# Altium schematic sheet Modulo bluetooth.SchDoc
size A3
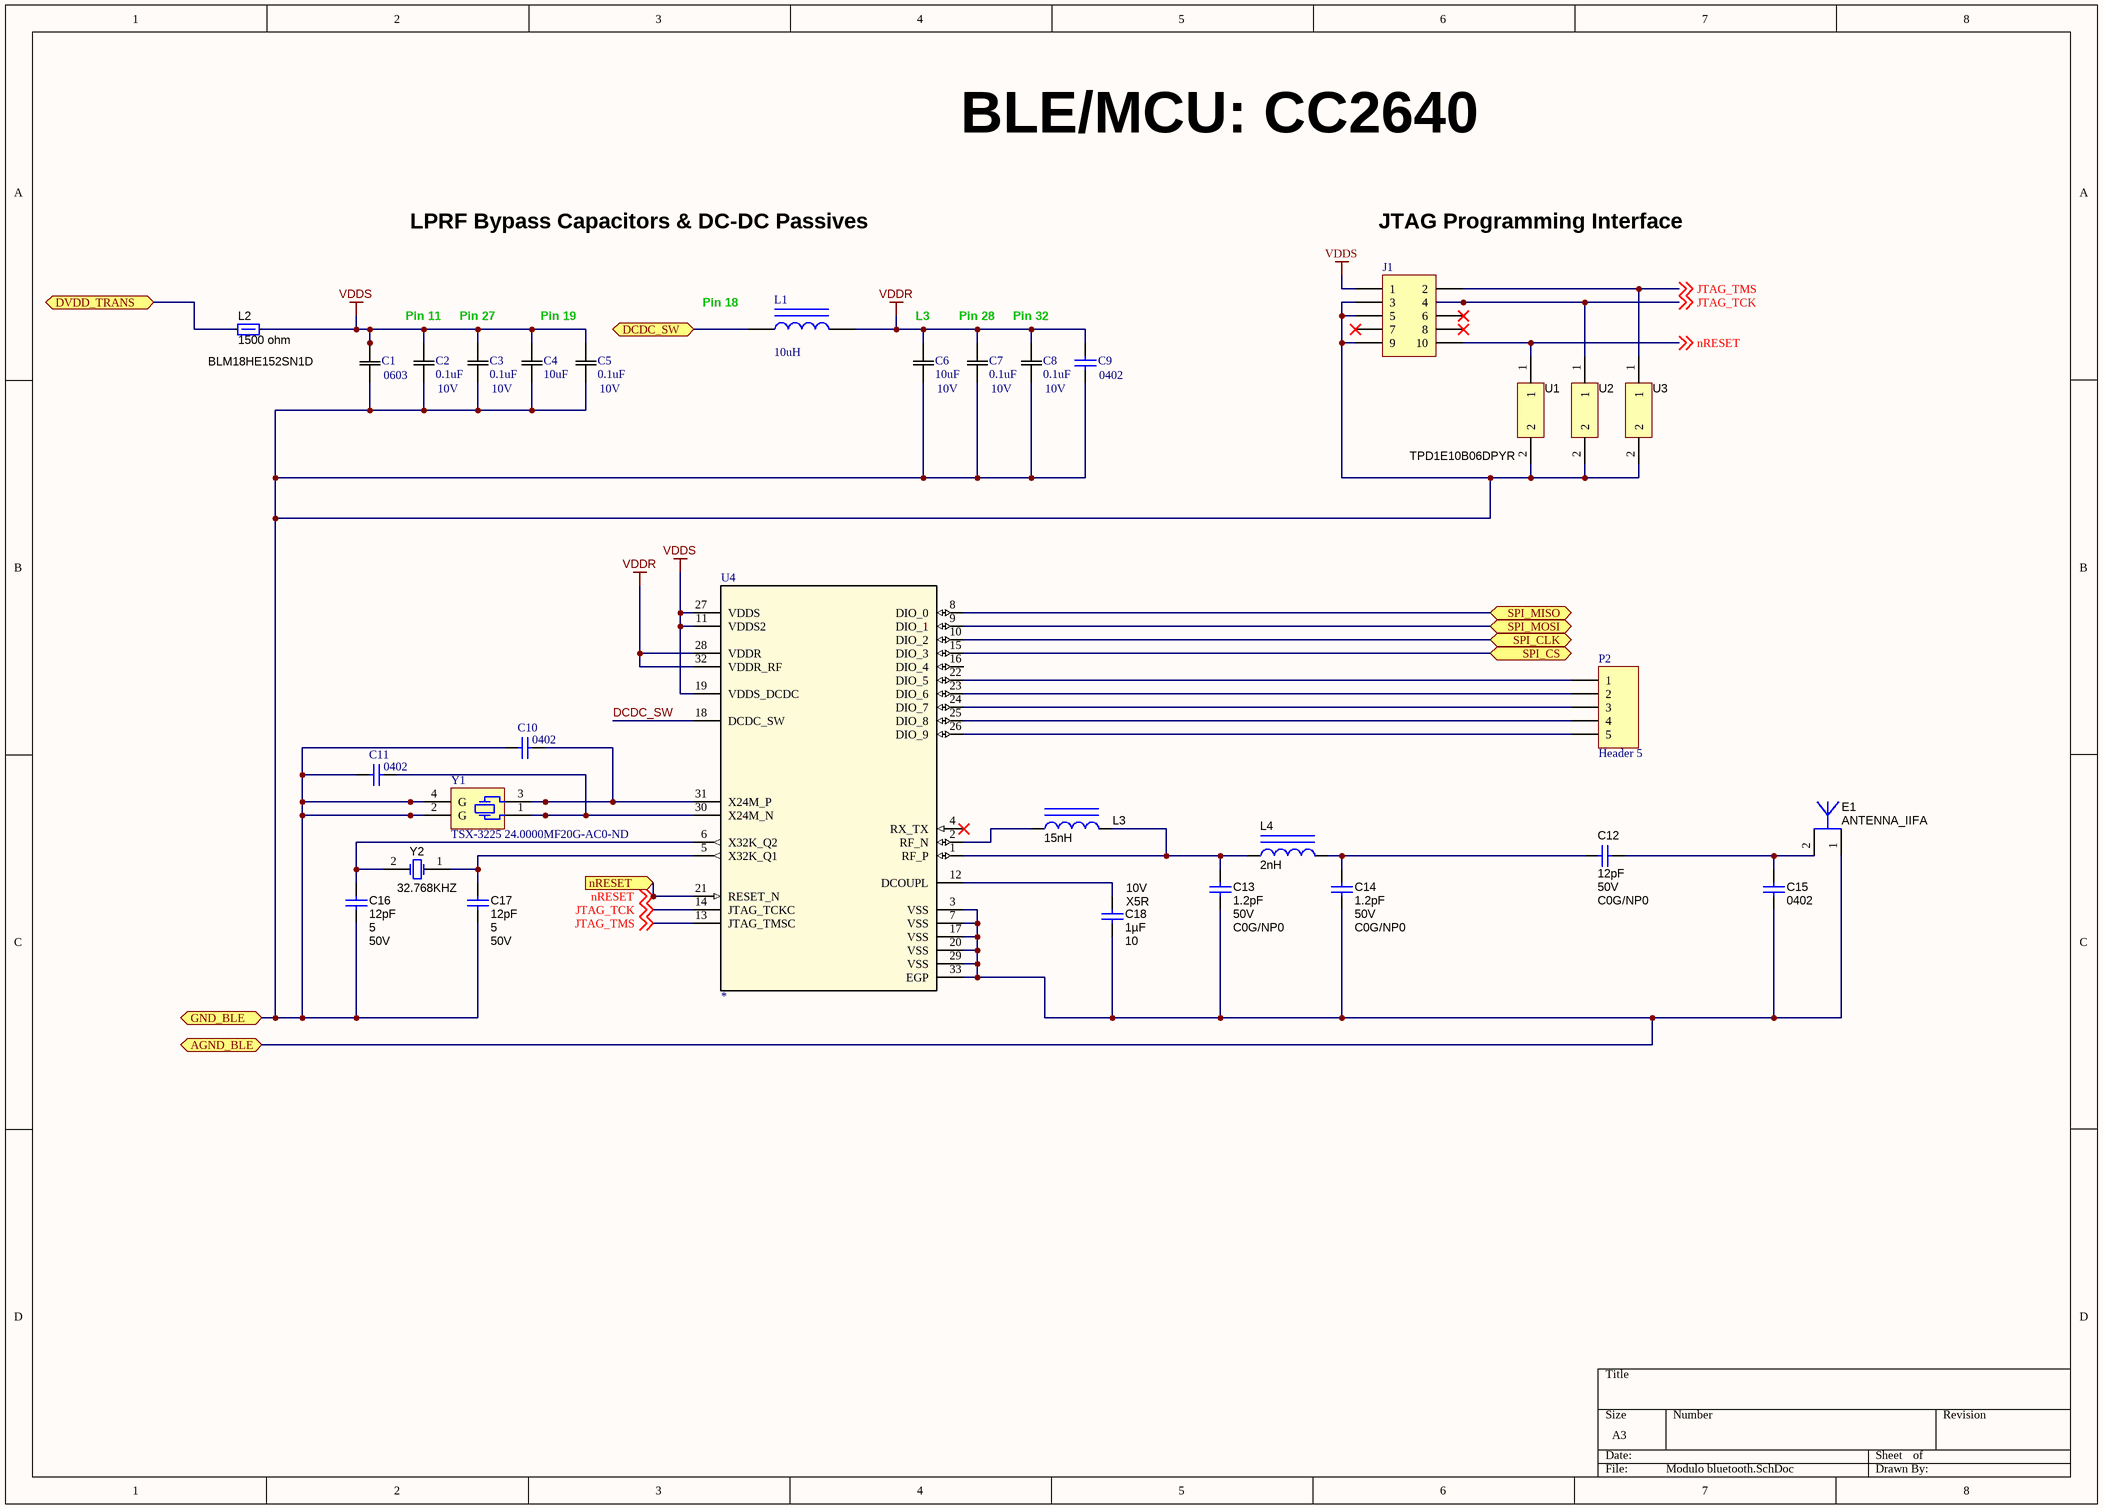
[diagram p0: Modulo bluetooth.SchDoc]

## Parts
C1  10uF  [0603]  (value not drawn)
C2  0.1uF  Value1: 10V  [0402]
C3  0.1uF  Value1: 10V  [0402]
C4  10uF  [0805_HV]
C5  0.1uF  Value1: 10V  [0402S]
C6  10uF  Value1: 10V  [0805_HV]
C7  0.1uF  Value1: 10V  [0402L]
C8  0.1uF  Value1: 10V  [0402L]
C9  Footprint: 0402  [0402L]
C10  (no value)  [0402]
C11  (no value)  [0402]
C12  ValueDisplayed: 12pF  Value2: 50V  TempCo: C0G/NP0  [0402L]  (hidden comment: GRM1555C1H120JA01D)
C13  ValueDisplayed: 1.2pF  Value2: 50V  TempCo: C0G/NP0  [0402L]  (hidden comment: GRM1555C1H1R2CA01D)
C14  ValueDisplayed: 1.2pF  Value2: 50V  TempCo: C0G/NP0  [0402L]  (hidden comment: GRM1555C1H1R2CA01D)
C15  GRM1555C1H1R2CA01D  [0402]  (value not drawn)
C16  ValueDisplayed: 12pF  Tolerance_%: 5  Value2: 50V  [0402]  (hidden comment: GRM1555C1H120JA01D)
C17  ValueDisplayed: 12pF  Tolerance_%: 5  Value2: 50V  [0402]  (hidden comment: GRM1555C1H120JA01D)
C18  ValueDisplayed: 1µF  Tolerance_%: 10  Value2: 10V  TempCo: X5R  [0402]  (hidden comment: GRM155R61A105KE15D)
E1  ANTENNA_IIFA  [ANTENNA_IIFA]  (net tie)
J1  (no value)  [CONN_GRPB052VWVN-RC]
L1  value 10uH  [0805_145]
L2  value 1500 ohm  [0603]  (hidden comment: BLM18HE152SN1D)
L3  ValueDisplayed: 15nH  [IND_LQG15H]  (hidden comment: LQG15HS15NJ02D)
L4  ValueDisplayed: 2nH  [IND_LQG15H]  (hidden comment: LQG15HS2N0S02D)
P2  Header 5  [HDR1X5]
U1  TPD1E10B06DPYR  [DPY0002A]  (value not drawn)
U2  TPD1E10B06DPYR  [DPY0002A]  (value not drawn)
U3  TPD1E10B06DPYR  [DPY0002A]
U4  *  [RSM0032B_NV]
Y1  TSX-3225 24.0000MF20G-AC0-ND  [EPSON_TSX-3225]
Y2  Frequency: 32.768KHZ  [Epson_FC-12M]  (hidden comment: FC-12M 32.7680KA-A3)

## Ports
AGND_BLE (bidir), DCDC_SW, DVDD_TRANS, GND_BLE (bidir), nRESET (in), SPI_CLK, SPI_CS, SPI_MISO, SPI_MOSI

## Nets
VDDR: C6.1 C7.1 C8.1 C9.2 L1.2 U4.28(VDDR) U4.32(VDDR_RF)
VDDS: C1.2 C2.1 C3.1 C4.1 C5.1 J1.1 L2.2 U4.11(VDDS2) U4.19(VDDS_DCDC) U4.27(VDDS)
AGND_BLE: C13.2 C14.2 C15.1 C18.1 E1.1 U4.3(VSS) U4.7(VSS) U4.17(VSS) U4.20(VSS) U4.29(VSS) U4.33(EGP) ; port AGND_BLE
DCDC_SW: U4.18(DCDC_SW)
DCDC_SW: L1.1 ; port DCDC_SW  [a separate net that carries the same name]
DVDD_TRANS: L2.1 ; port DVDD_TRANS
GND_BLE: C1.1 C2.2 C3.2 C4.2 C5.2 C6.2 C7.2 C8.2 C9.1 C10.2 C11.2 C16.1 C17.2 J1.3 J1.5 J1.9 U1.2 U2.2 U3.2 Y1.2(G) Y1.4(G) ; port GND_BLE
JTAG_TCK: J1.4 U2.1 U4.14(JTAG_TCKC) ; off-sheet JTAG_TCK
JTAG_TMS: J1.2 U3.1 U4.13(JTAG_TMSC) ; off-sheet JTAG_TMS
nRESET: J1.10 U1.1 U4.21(RESET_N) ; off-sheet nRESET, port nRESET
SPI_CLK: U4.10(DIO_2) ; port SPI_CLK
SPI_CS: U4.15(DIO_3) ; port SPI_CS
SPI_MISO: U4.8(DIO_0) ; port SPI_MISO
SPI_MOSI: U4.9(DIO_1) ; port SPI_MOSI
NetC10_1: C10.1 U4.31(X24M_P) Y1.3
NetC11_1: C11.1 U4.30(X24M_N) Y1.1
NetC12_1: C12.1 C15.2 E1.2
NetC12_2: C12.2 C14.1 L4.2
NetC13_1: C13.1 L3.2 L4.1 U4.1(RF_P)
NetC16_2: C16.2 U4.6(X32K_Q2) Y2.2(OSC2)
NetC17_1: C17.1 U4.5(X32K_Q1) Y2.1(OSC1)
NetC18_2: C18.2 U4.12(DCOUPL)
NetL3_1: L3.1 U4.2(RF_N)
NetP2_1: P2.1 U4.22(DIO_5)
NetP2_2: P2.2 U4.23(DIO_6)
NetP2_3: P2.3 U4.24(DIO_7)
NetP2_4: P2.4 U4.25(DIO_8)
NetP2_5: P2.5 U4.26(DIO_9)

Not connected (* = marked no-connect by the designer): J1 6* 7* 8*; U4 4(RX_TX)* 16(DIO_4)

## Notes on the sheet
- BLE/MCU: CC2640
- LPRF Bypass Capacitors & DC-DC Passives
- JTAG Programming Interface
- Pin 11
- Pin 27
- Pin 19
- (near L1) Pin 18
- (near C6) L3
- Pin 28
- Pin 32

## Library data of the parts
C1 = C1608X5R1A106M08: Imported; Manufacturer_Part_Number: C1608X5R1A106M080AC; Vendor: TDK; C: Copyright (C) 2015 Accelerated Designs. All rights reserved; Value: 10uF; Copyright: Copyright (C) 2015 Accelerated Designs. All rights reserved
C2 C3 C5-C8 = GRM155R71A104KA0: Imported; Manufacturer_Part_Number: GRM155R71A104KA01D; Vendor: Murata; C: Copyright (C) 2015 Accelerated Designs. All rights reserved; Copyright: Copyright (C) 2015 Accelerated Designs. All rights reserved
  C2 C3 C5 C7 C8: Value: 0.1uF
  C6: Value: 10uF
C4 = GRM155R71A104KA0: Imported; Manufacturer_Part_Number: GRM155R71A104KA01D; Vendor: Murata; C: Copyright (C) 2015 Accelerated Designs. All rights reserved; Value1: 10V; Value: 10uF; Copyright: Copyright (C) 2015 Accelerated Designs. All rights reserved
C9 = Cap Semi: Capacitor (Semiconductor SIM Model); Value: 10uF; PackageReference: C1206; Published: 8-Jun-2000; Publisher: Altium Limited; LatestRevisionDate: 29-May-2009; LatestRevisionNote: IPC-7351 Footprint Added.; PackageDescription: Chip Capacitor
C10 C11 = Cap Semi: Capacitor (Semiconductor SIM Model); Value: 12pF; PackageReference: C1206; Published: 8-Jun-2000; Publisher: Altium Limited; LatestRevisionDate: 29-May-2009; LatestRevisionNote: IPC-7351 Footprint Added.; PackageDescription: Chip Capacitor
C12 = GRM1555C1H120JA01D: CAP, CERM, 12 pF, 50 V, +/- 5%, C0G/NP0, 0402; Manufacturer: MuRata; Polarized: N; CompType: Capacitor; Value: 12pF; U/M: EA; Cap_F: 0.000000000012; Tolerance_%: 5; Value1: Unknown; VDC_V: 50; TaMin_C: -55; TaMax_C: 125; Cap_Case: 0402; AEC Category: Q200; SymbolVersion: 2008-07-09; PartNumber: GRM1555C1H120JA01D; PackageReference: 0402; RoHS: Y; MountType: SMT; Technology: Ceramic; Published: 2008-06-19; Publisher: Texas Instruments; LatestRevisionDate: 2016-02-01; ComponentLink1Description: Datasheet link; ComponentLink1URL: http://search.murata.co.jp/Ceramy/PnsearchViewAction.do?HnOFG=ON&HnNFG=ON&SEL_CNT=50&sLang=en&sKey=GRM1555C1H120JA01D&x=9&y=9&search=startwith; Supplier 1: Mouser; Supplier Part Number 1: 81-GRM1555C1H120JA1D; Supplier 2: Farnell; Supplier Part Number 2: 1828875; Supplier 3: Newark; Supplier Part Number 3: 14T3292; AEC Qualified: ?
C13 C14 = GRM1555C1H1R2CA01D: CAP, CERM, 1.2 pF, 50 V, +/- 5%, C0G/NP0, 0402; Manufacturer: MuRata; Polarized: N; CompType: Capacitor; Value: 1.2pF; U/M: EA; Cap_F: 0.0000000000012; Tolerance_%: 5; Value1: Unknown; VDC_V: 50; TaMin_C: -55; TaMax_C: 125; Cap_Case: 0402; AEC Category: Q200; SymbolVersion: 2008-07-09; PartNumber: GRM1555C1H1R2CA01D; PackageReference: 0402; RoHS: Y; MountType: SMT; Technology: Ceramic; Published: 2008-06-19; Publisher: Texas Instruments; LatestRevisionDate: 2016-02-01; ComponentLink1Description: Datasheet link; ComponentLink1URL: http://search.murata.co.jp/Ceramy/image/img/PDF/ENG/GRM1555C1H1R2CA01.pdf; Supplier 1: Mouser; Supplier Part Number 1: 81-GRM1555C1H1R2CA1D; AEC Qualified: ?
C15 = GRM1555C1H1R2CA01D: CAP, CERM, 1.2 pF, 50 V, +/- 5%, C0G/NP0, 0402; Manufacturer: MuRata; Polarized: N; CompType: Capacitor; Value: 1.2pF; U/M: EA; Cap_F: 0.0000000000012; Tolerance_%: 5; Value1: Unknown; VDC_V: 50; Value2: 50V; TaMin_C: -55; TaMax_C: 125; AEC Category: Q200; SymbolVersion: 2008-07-09; PartNumber: GRM1555C1H1R2CA01D; ValueDisplayed: 1.2pF; PackageReference: 0402; RoHS: Y; MountType: SMT; Technology: Ceramic; TempCo: C0G/NP0; Cap_Case: 0402; Published: 2008-06-19; Publisher: Texas Instruments; LatestRevisionDate: 2016-02-01; ComponentLink1Description: Datasheet link; ComponentLink1URL: http://search.murata.co.jp/Ceramy/image/img/PDF/ENG/GRM1555C1H1R2CA01.pdf; Supplier 1: Mouser; Supplier Part Number 1: 81-GRM1555C1H1R2CA1D; AEC Qualified: ?
C16 C17 = GRM1555C1H120JA01D: CAP, CERM, 12 pF, 50 V, +/- 5%, C0G/NP0, 0402; Manufacturer: MuRata; Polarized: N; CompType: Capacitor; Value: 12pF; U/M: EA; Cap_F: 0.000000000012; Value1: Unknown; VDC_V: 50; TaMin_C: -55; TaMax_C: 125; AEC Category: Q200; SymbolVersion: 2008-07-09; PartNumber: GRM1555C1H120JA01D; PackageReference: 0402; RoHS: Y; MountType: SMT; Technology: Ceramic; TempCo: C0G/NP0; Cap_Case: 0402; Published: 2008-06-19; Publisher: Texas Instruments; LatestRevisionDate: 2016-02-01; ComponentLink1Description: Datasheet link; ComponentLink1URL: http://search.murata.co.jp/Ceramy/PnsearchViewAction.do?HnOFG=ON&HnNFG=ON&SEL_CNT=50&sLang=en&sKey=GRM1555C1H120JA01D&x=9&y=9&search=startwith; Supplier 1: Mouser; Supplier Part Number 1: 81-GRM1555C1H120JA1D; Supplier 2: Farnell; Supplier Part Number 2: 1828875; Supplier 3: Newark; Supplier Part Number 3: 14T3292; AEC Qualified: ?
C18 = GRM155R61A105KE15D: CAP, CERM, 1 µF, 10 V, +/- 10%, X5R, 0402; Manufacturer: MuRata; Polarized: N; CompType: Capacitor; Value: 1uF; U/M: EA; Cap_F: 0.000001; Value1: Unknown; TaMin_C: -55; TaMax_C: 85; AEC Category: Q200; SymbolVersion: 2008-07-09; PartNumber: GRM155R61A105KE15D; PackageReference: 0402; RoHS: Y; VDC_V: 10; MountType: SMT; Technology: Ceramic; Cap_Case: 0402; Published: 2008-06-19; Publisher: Texas Instruments; LatestRevisionDate: 2016-01-22; ComponentLink1Description: Datasheet link; ComponentLink1URL: http://search.murata.co.jp/Ceramy/PnsearchViewAction.do?HnOFG=ON&HnNFG=ON&SEL_CNT=50&sLang=en&sKey=GRM155R61A105KE15D&x=9&y=9&search=startwith; Supplier 1: Digi-Key; Supplier Part Number 1: 490-3890-1-ND; Supplier 2: Mouser; Supplier Part Number 2: 81-GRM155R61A105KE15; Supplier 3: Farnell; Supplier Part Number 3: 1735523; AEC Qualified: ?
E1 = ANTENNA_IIFA: PCB Antenna.  There is nothing to buy or mount.; SymbolCreator: Altium; SymbolVersion: 2014-08-20; PartNumber: ANTENNA_IIFA; Manufacturer: N/A; CompType: Antenna; MountType: N/A; ComponentLink1Description: Datasheet Link; ComponentLink1URL: http://www.ti.com/lit/an/swra117d/swra117d.pdf; PackageReference: PCB Antenna, 2-Leads; Publisher: Texas Instruments; LatestRevisionDate: 2015-03-27
J1 = Header 5X2: Header, 5-Pin, Dual row; Publisher: Altium Limited; LatestRevisionDate: 17-Jul-2002; LatestRevisionNote: Re-released for DXP Platform.
L1 = Inductor Iron: Magnetic-Core Inductor; PackageReference: AXIAL-0.9; Published: 24-Mar-1999; Publisher: Altium Limited; LatestRevisionDate: 17-Jul-2002; LatestRevisionNote: Re-released for DXP Platform.; PackageDescription: Axial Device, Thru-Hole; 2 Leads; 0.9 in Pin Spacing
L2 = BLM18HE152SN1D: Ferrite Bead, 1500 ohm @ 100 MHz, 0.5 A, 0603; Manufacturer: MuRata; Imax_A: 0.5; Value1: 0.5 ohm; Value2: 0.5A; ZTyp@100MHz_Ohm: 1500; CompType: Ferrite Bead; SymbolVersion: 2009-06-02; PartNumber: BLM18HE152SN1D; DCR_ohm: 0.5; MountType: SMT; PackageReference: 0603; Published: 2014-04-30; Publisher: Texas Instruments; LatestRevisionDate: 2016-02-02; ComponentLink1Description: Datasheet link; ComponentLink1URL: http://search.murata.co.jp/Ceramy/image/img/PDF/ENG/L0110S0101BLM18H.pdf; RoHS: Y; Ztyp@1GHz_Ohm: 1500; Supplier 1: Digi-Key; Supplier Part Number 1: 490-5216-1-ND; Supplier 2: Mouser; Supplier Part Number 2: 81-BLM18HE152SN1D; Supplier 3: Farnell; Supplier Part Number 3: 2443237RL
L3 = LQG15HS15NJ02D: Inductor, Multilayer, Air Core, 15 nH, 0.3 A, 0.32 ohm, SMD; Manufacturer: MuRata; Value: 15nH; Ind_H: 15.0E-9; Imax_A: 0.3; Irms: 0.3A @ C rise; Isat: 0.3A @ % inductance drop; DCR_ohm: 0.32; Value2: 0.3A; AEC Category: Q200; SymbolVersion: 2008-07-23; CompType: Inductor; PartNumber: LQG15HS15NJ02D; Value1: 0.32 ohm; Technology: Multilayer; MountType: SMT; Material: Air Core; PackageReference: 0402 polarized; Published: 2008-06-26; Publisher: Texas Instruments; LatestRevisionDate: 2016-01-08; ComponentLink1Description: Datasheet link; ComponentLink1URL: http://search.murata.co.jp/Ceramy/image/img/PDF/ENG/L0075S0083LQG15HS.pdf; RoHS: Y; Supplier 1: Digi-Key; Supplier Part Number 1: 490-2625-1-ND; Supplier 2: Mouser; Supplier Part Number 2: 81-LQG15HS15NJ02D; AEC Qualified: ?
L4 = LQG15HS2N0S02D: Inductor, Multilayer, Air Core, 2 nH, 0.3 A, 0.1 ohm, SMD; Manufacturer: MuRata; Value: 2nH; Ind_H: 2.0E-9; Imax_A: 0.3; Irms: 0.3A @ C rise; Isat: 0.3A @ % inductance drop; DCR_ohm: 0.1; Value1: 0.1 ohm; Value2: 0.3A; AEC Category: Q200; SymbolVersion: 2008-07-23; CompType: Inductor; PartNumber: LQG15HS2N0S02D; Technology: Multilayer; MountType: SMT; Material: Air Core; PackageReference: 0402 polarized; Published: 2008-06-26; Publisher: Texas Instruments; LatestRevisionDate: 2016-01-08; ComponentLink1Description: Datasheet link; ComponentLink1URL: http://search.murata.co.jp/Ceramy/image/img/PDF/ENG/L0075S0083LQG15HS.pdf; RoHS: Y; Supplier 1: Digi-Key; Supplier Part Number 1: 490-6569-1-ND; Supplier 2: Mouser; Supplier Part Number 2: 81-LQG15HS2N0S02D; AEC Qualified: ?
P2 = Header 5: Header, 5-Pin; LatestRevisionDate: 17-Jul-2002; LatestRevisionNote: Re-released for DXP Platform.; Publisher: Altium Limited
U1-U3 = TPD1E10B06DPYR: ESD in 0402 Package with 10 pF Capacitance and 6 V Breakdown, 1 Channel, -40 to +125 degC, 2-pin X2SON (DPY), Green (RoHS & no Sb/Br); Manufacturer: Texas Instruments; Alternate Manufacturer: None; Alternate PartNumber: Equivalent; Breakdown Voltage(Min)(V): 6; Eco-Plan: TBD; IEC 61000-4-2 Air-Gap(+/- kV): 30; IO Capacitance(Typ)(pF): 10; SubFamily: ESD Solution; DatasheetVersion: SLLSEB1; PackageVersion: revA, Apr-2010; PackageReference: DPY0002A; PackageDescription: 2-Pin Plastic Small Outline No-Lead 1.0 x 0.6 x 0.4 mm Body; Supplier 1: Digi-Key; Supplier Part Number 1: 296-30406-2-ND; Supplier 2: Digi-Key; Supplier Part Number 2: 296-30406-1-ND; Supplier 3: Digi-Key; Supplier Part Number 3: 296-30406-6-ND; Supplier 4: Newark; Supplier Part Number 4: 94T1842; Supplier 5: Mouser; Supplier Part Number 5: 595-TPD1E10B06DPYR; IEC 61000-4-2 Contact(+/- kV): 30; IO Leakage Current(nA): 10; MountType: SMT; PartNumber: TPD1E10B06DPYR; ComponentLink1Description: Datasheet; ComponentLink1URL: http://www.ti.com/general/docs/lit/getliterature.tsp?genericPartNumber=TPD1E10B06&fileType=pdf; ComponentLink2Description: URL Link1; ComponentLink2URL: SamplesURL:http://www.ti.com/product/tpd1e10b06#samples
U4 = CC2640R2FRSMR_1: Imported; Manufacturer: Texas Instruments; PartNumber: CC2640R2FRSMR; RefDes: RefDes; TYPE: TYPE; Value: Value
Y1 = TSX-3225 24.0000MF20G-AC3: Supplier 1: Digikey; Supplier Part Number 1: TSX-3225 24.0000MF20G-AC0-ND
Y2 = FC-12M 32.7680KA-A3: Crystal, 32.768kHz, 12.5pF, SMD; Manufacturer: Epson; SymbolCreator: a0412235; U/M: EA; TaMin_C: -40; TaMax_C: 85; Frequency Stability: ±20ppm; SymbolVersion: 2008-07-09; PartNumber: FC-12M 32.7680KA-A3; CompType: Crystal; PackageReference: Crystal 2.05x.6x1.2mm; MountType: SMT; RoHS: Y; ComponentLink1Description: Datasheet Link; ComponentLink1URL: http://www.eea.epson.com/portal/pls/portal/docs/1/1587453.PDF; Publisher: Texas Instruments; LatestRevisionDate: 2015-03-19; Supplier 1: Digi-Key; Supplier Part Number 1: SER3672CT-ND; Supplier 2: Mouser; Supplier Part Number 2: 732-FC-12M-32.76KAA3